# Altium schematic sheet sheet1.SchDoc
size A4; SheetNumber: 1; SheetTotal: 1
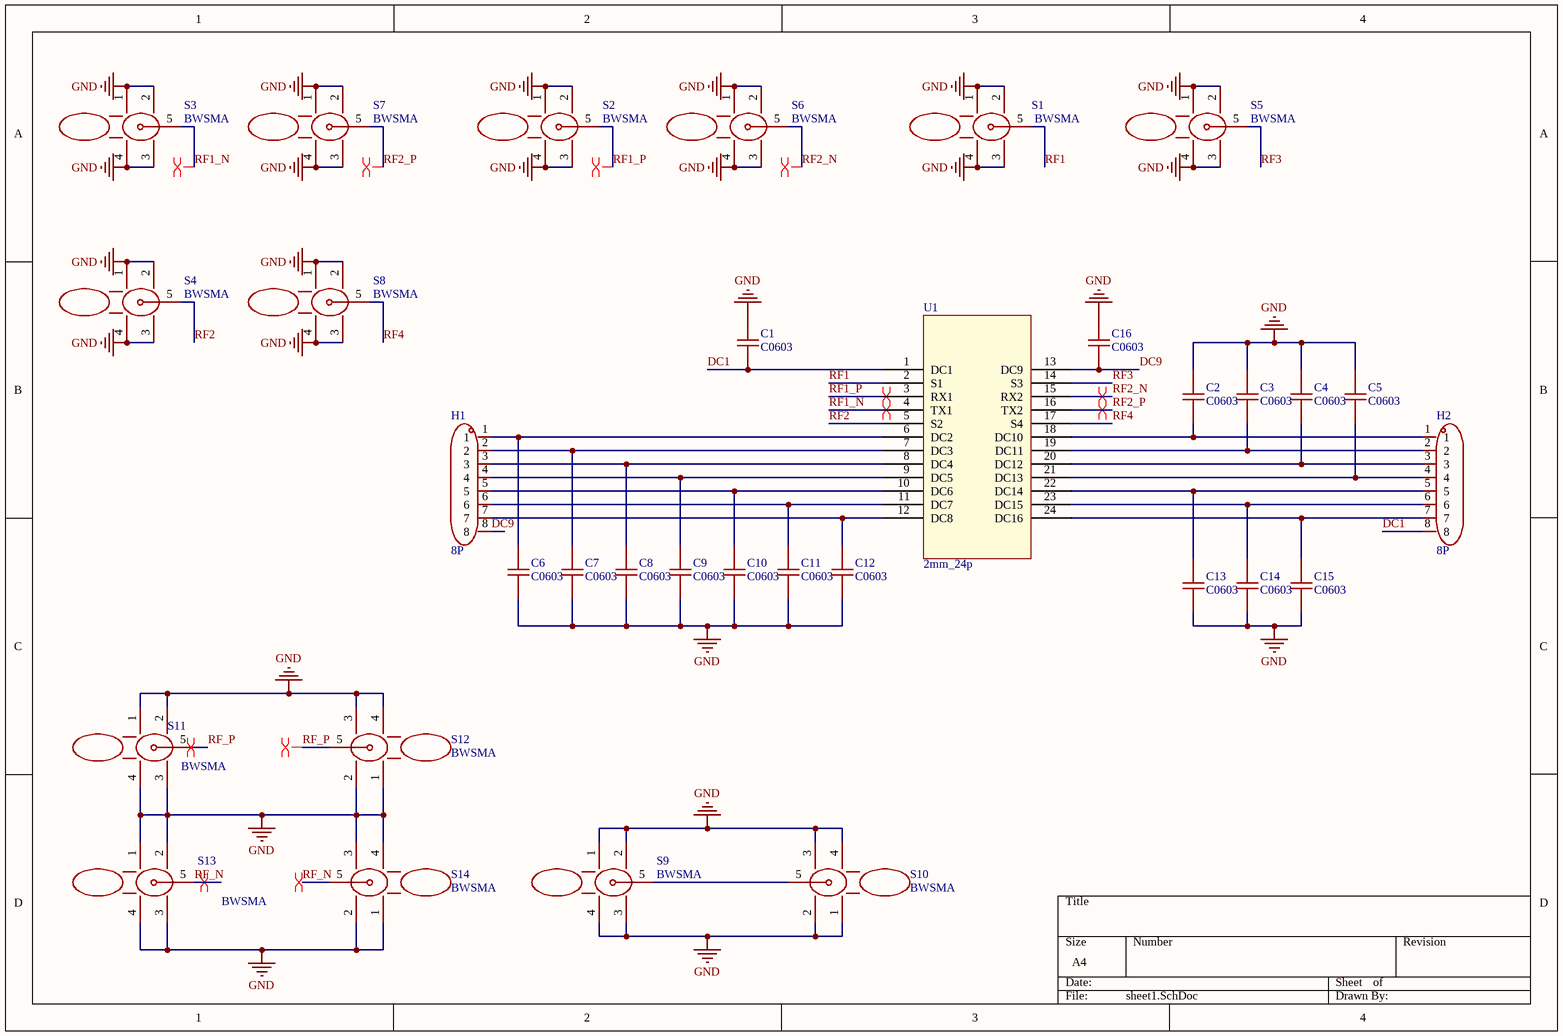
[diagram p0: sheet1.SchDoc]

## Parts
C1  C0603  [C0603]
C2  C0603  [C0603]
C3  C0603  [C0603]
C4  C0603  [C0603]
C5  C0603  [C0603]
C6  C0603  [C0603]
C7  C0603  [C0603]
C8  C0603  [C0603]
C9  C0603  [C0603]
C10  C0603  [C0603]
C11  C0603  [C0603]
C12  C0603  [C0603]
C13  C0603  [C0603]
C14  C0603  [C0603]
C15  C0603  [C0603]
C16  C0603  [C0603]
H1  8P  [8P]
H2  8P  [8P]
S1  BWSMA  [BWSMA]
S2  BWSMA  [BWSMA]
S3  BWSMA  [BWSMA]
S4  BWSMA  [BWSMA]
S5  BWSMA  [BWSMA]
S6  BWSMA  [BWSMA]
S7  BWSMA  [BWSMA]
S8  BWSMA  [BWSMA]
S9  BWSMA  [BWSMA]
S10  BWSMA  [BWSMA]
S11  BWSMA  [BWSMA]
S12  BWSMA  [BWSMA]
S13  BWSMA  [BWSMA]
S14  BWSMA  [BWSMA]
U1  2mm_24p  [2MM_8AC_16DC]

## Nets
GND: C1.2 C2.2 C3.2 C4.2 C5.2 C6.1 C7.1 C8.1 C9.1 C10.1 C11.1 C12.1 C13.1 C14.1 C15.1 C16.2 S1.1 S1.2 S1.3 S1.4 S2.1 S2.2 S2.3 S2.4 S3.1 S3.2 S3.3 S3.4 S4.1 S4.2 S4.3 S4.4 S5.1 S5.2 S5.3 S5.4 S6.1 S6.2 S6.3 S6.4 S7.1 S7.2 S7.3 S7.4 S8.1 S8.2 S8.3 S8.4 S9.1 S9.2 S9.3 S9.4 S10.1 S10.2 S10.3 S10.4 S11.1 S11.2 S11.3 S11.4 S12.1 S12.2 S12.3 S12.4 S13.1 S13.2 S13.3 S13.4 S14.1 S14.2 S14.3 S14.4
DC1: C1.1 H2.8 U1.1(DC1)
DC9: C16.1 H1.8 U1.13(DC9)
RF1: S1.5 U1.2(S1)
RF1_N: S3.5 U1.4(TX1)
RF1_P: S2.5 U1.3(RX1)
RF2: S4.5 U1.5(S2)
RF2_N: S6.5 U1.15(RX2)
RF2_P: S7.5 U1.16(TX2)
RF3: S5.5 U1.14(S3)
RF4: S8.5 U1.17(S4)
RF_N: S13.5 S14.5
RF_P: S11.5 S12.5
NetC2_1: C2.1 H2.1 U1.18(DC10)
NetC3_1: C3.1 H2.2 U1.19(DC11)
NetC4_1: C4.1 H2.3 U1.20(DC12)
NetC5_1: C5.1 H2.4 U1.21(DC13)
NetC6_2: C6.2 H1.1 U1.6(DC2)
NetC7_2: C7.2 H1.2 U1.7(DC3)
NetC8_2: C8.2 H1.3 U1.8(DC4)
NetC9_2: C9.2 H1.4 U1.9(DC5)
NetC10_2: C10.2 H1.5 U1.10(DC6)
NetC11_2: C11.2 H1.6 U1.11(DC7)
NetC12_2: C12.2 H1.7 U1.12(DC8)
NetC13_2: C13.2 H2.5 U1.22(DC14)
NetC14_2: C14.2 H2.6 U1.23(DC15)
NetC15_2: C15.2 H2.7 U1.24(DC16)
NetS9_5: S9.5 S10.5

## Layout directives
differential pair: RF1_N, RF1_P, RF2_N, RF2_P, RF_N, RF_P